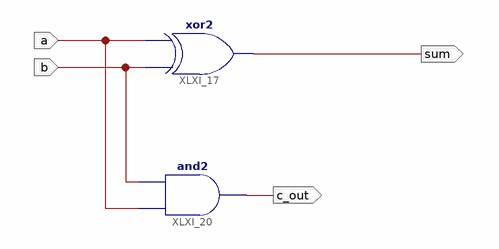
[diagram p0: schematic sheet 1]
// Xilinx ISE schematic ha_1bit.sch (spartan3e) as structural Verilog: 2 symbols, 4 ports
module ha_1bit (
  input  a,
  input  b,
  output c_out,
  output sum
);

  xor XLXI_17 (sum, b, a);
  and XLXI_20 (c_out, a, b);
endmodule
